# Altium schematic sheet SD Card Breakout.SchDoc
size A
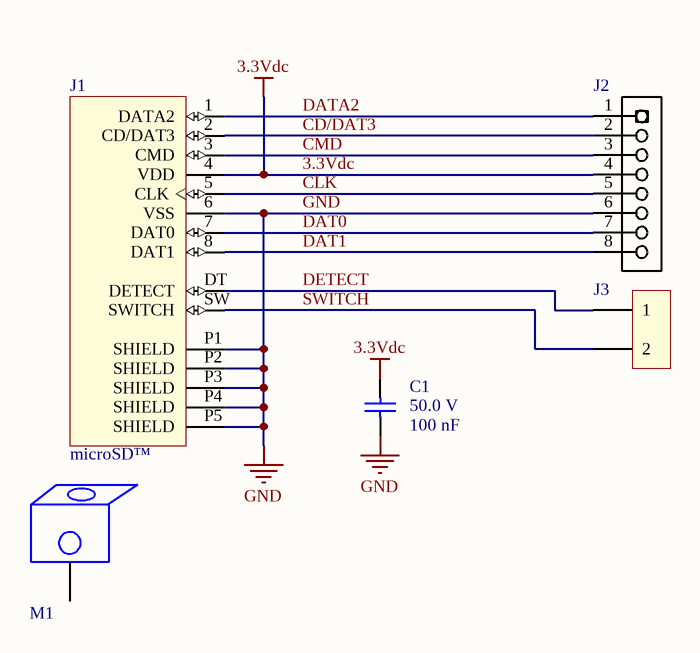
[diagram p0: SD Card Breakout.SchDoc]

## Parts
C1  Voltage Rating (DC): 50.0 V  Capacitance: 100 nF  [Cap,0805]  (hidden comment: Cap)
J1  Card Type: microSD™  [Conn,SD micro,503182-1852]  (hidden comment: 5031821852)
J2  HEADER,0.1",8Pin,SinlgeRow  [Header,8Pin,SingleRow, RA,0.1"]  (value not drawn)
J3  Generic Header  [HEADER-1X2,0.1",RA1]  (value not drawn)
M1  4334  [Mech,Bracket,RA,#6,Threaded]  (value not drawn)  (mechanical)

## Nets
3.3Vdc: C1.2 J1.4(VDD) J2.4
GND: C1.1 J1.6(VSS) J1.P1(SHIELD) J1.P2(SHIELD) J1.P3(SHIELD) J1.P4(SHIELD) J1.P5(SHIELD) J2.6
CD/DAT3: J1.2(CD/DAT3) J2.2
CLK: J1.5(CLK) J2.5
CMD: J1.3(CMD) J2.3
DAT0: J1.7(DAT0) J2.7
DAT1: J1.8(DAT1) J2.8
DATA2: J1.1(DATA2) J2.1
DETECT: J1.DT(DETECT) J3.1
SWITCH: J1.SW(SWITCH) J3.2

Not connected (* = marked no-connect by the designer): M1 1

## Library data of the parts
C1 = Cap,0805,100nf,50V,5%,08055C104JAT2A: Capacitor; Ceramic; Cap 0.1 uF; Tol 5%; Vol-Rtg 50 VDC; SMT; 0805; X7R; Tape & Reel; Lead-Free Status: Lead Free; Case/Package (SI): 2012; Insulation Resistance: 100 GΩ; Detailed Description: 0.1µF ±5% 50V Ceramic Capacitor X7R 0805 (2012 Metric); Mounting Style: Surface Mount; Packaging: Tape & Reel (TR), Cut Tape (CT); RoHS: Compliant; Size-Width: 1.24 mm; Case/Package: 0805; Number of Pins: 2; digikey url: http://www.digikey.ca/product-detail/en/avx-corporation/08055C104JAT2A/478-3352-1-ND/930144; REACH SVHC Compliance: No SVHC; Dielectric Characteristic: X7R; Capacitance Tolerance: ±5%; Size-Length: 2.01 mm; Size-Height: 710 µm; Size-Thickness: 940 µm; Manufacturer Part Number: 08055C104JAT2A; Octopart URL: http://octopart.com/08055c104jat2a-avx-55388010; Operating Temperature: -55°C ~ 125°C
J1 = Conn,SD Micro,10 (8 + 2) Position,SMD,RA,5031821852: MICRO SD NORMAL ULTRALOWPRO8CKTE; Manufacturer: Molex; Detailed Description: 10 (8 + 2) Position Card Connector microSD™ Surface Mount, Right Angle Gold; Categories: Connectors, Interconnects   Memory Connectors - PC Card Sockets; Connector Type: Connector and Ejector; Insertion, Removal Method: Push In, Push Out; mfg P/N: 5031821852; Series: 503182; Part Status: Active; Number of Positions: 10 (8 + 2); Mounting Type: Surface Mount, Right Angle; Features: Switch; Height Above Board: 0.057" (1.45mm); Mounting Feature: Normal, Standard - Top; Contact Finish: Gold
J3 = Header 1x2,0.1"Spacing
M1 = Mech,Bracket,RA,Threaded,4334: Mounting Bracket Short L #6-32 (2) Steel, Nickel Plated; Manufacturer: Keystone Electronics; Thread/Screw/Hole: Size #6-32 (2); mfg P/N: 4334; Type: Bracket, Threaded Hole(s); Material: Steel, Nickel Plated
J2 = HEADER,0.1",8Pin,SinlgeRow: Supplier 1: Digi-Key; Supplier Part Number 1: S1011E-36-ND